# EAGLE design Un_Net_v1.1 (EAGLE 7.3.0)
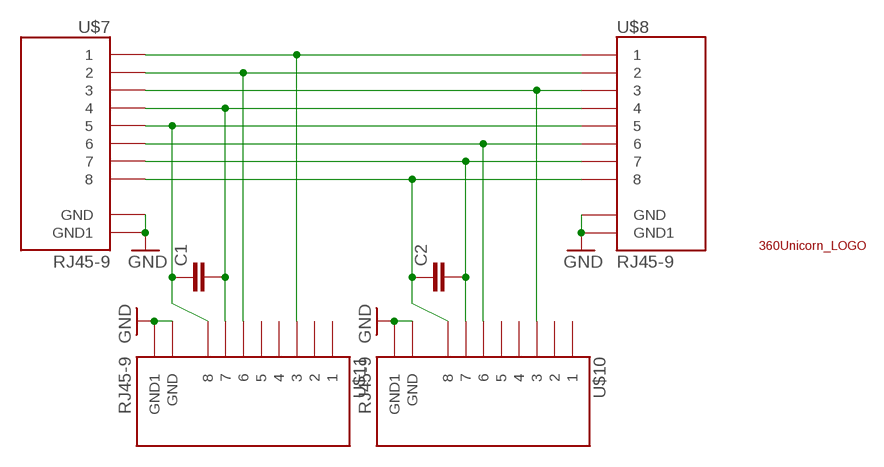
[diagram p0: schematic, sheet 1]

## Parts
C1  CAP1206  [1206]
C2  CAP1206  [1206]
U$1  360UNICORN_LOGO_1Z  [360UNICORN_LOGO_1Z]
U$7  RJ45-9  [RJ45-9]
U$8  RJ45-9  [RJ45-9]
U$10  RJ45-9  [RJ45-9]
U$11  RJ45-9  [RJ45-9]

## Nets
GND: U$7.9(GND) U$7.10(GND1) U$8.9(GND) U$8.10(GND1) U$10.9(GND) U$10.10(GND1) U$11.9(GND) U$11.10(GND1)
N$1: U$7.1 U$8.1 U$11.3
N$2: U$7.2 U$8.2 U$11.6
N$3: U$7.3 U$8.3 U$10.3
N$4: C2.2 U$7.7 U$8.7 U$10.7
N$7: U$7.6 U$8.6 U$10.6
N$8: C1.1 U$7.5 U$8.5 U$11.8
N$9: C1.2 U$7.4 U$8.4 U$11.7
N$10: C2.1 U$7.8 U$8.8 U$10.8
Unconnected: U$10.1 U$10.2 U$10.4 U$10.5 U$11.1 U$11.2 U$11.4 U$11.5

## Library data of the parts
C1 C2 = 2SparkFun:CAP: Capacitor Standard 0603 ceramic capacitor, and 0.1" leaded capacitor.
U$1 = 2SparkFun:360UNICORN_LOGO
U$7 U$8 U$10 U$11 = 2SparkFun:RJ45-9

## Board
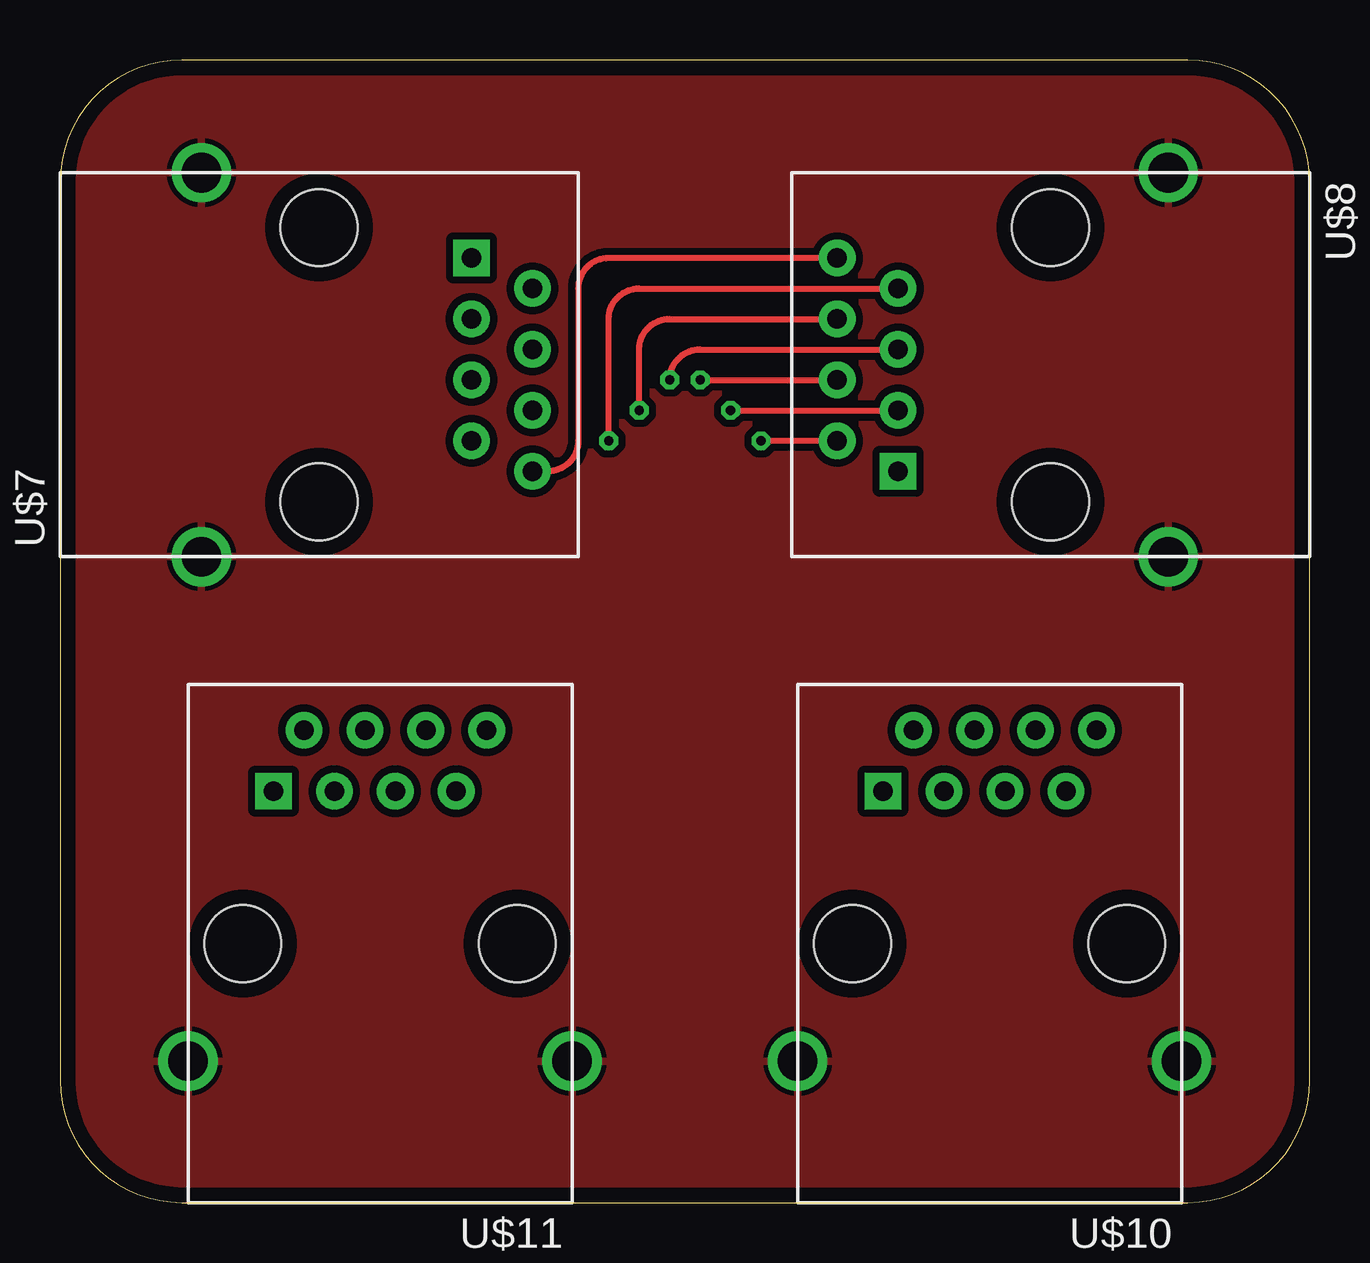
[diagram p1: board, top side]
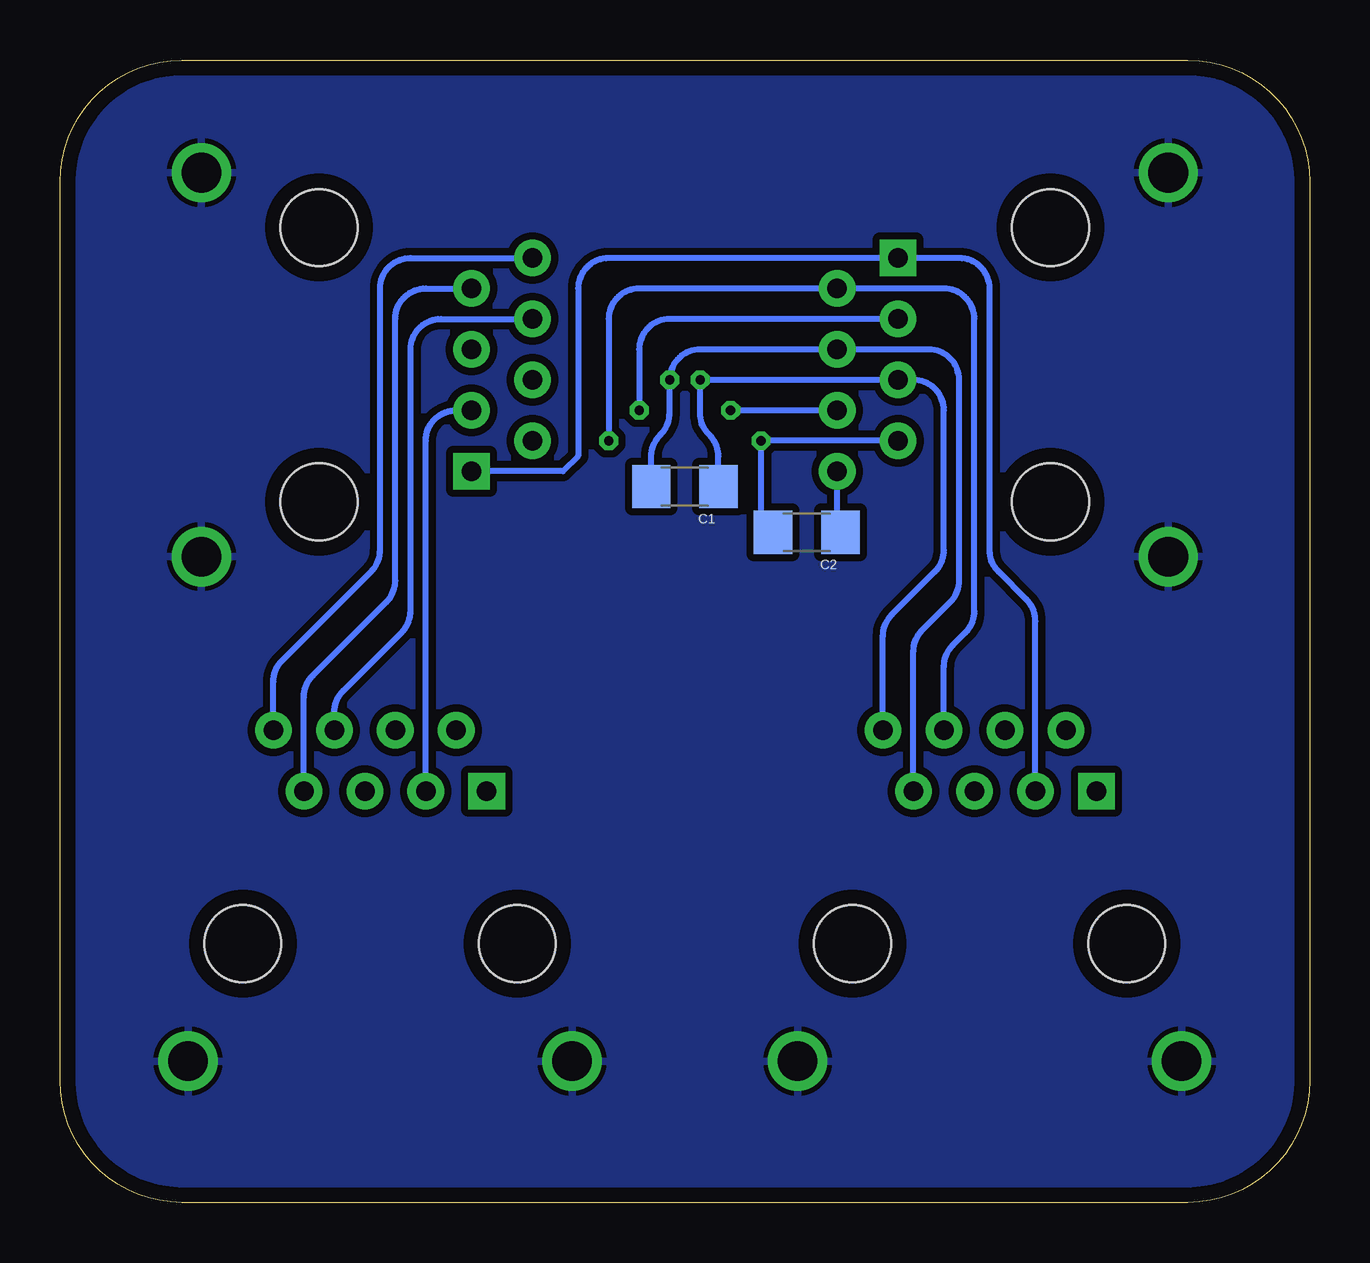
[diagram p2: board, bottom side, seen from below]

Size 52.07 x 47.62 mm. Coordinates in mm from the lower left corner, seen from the top.
Outline: 0,42.55 0,5.08 arc90 5.08,0 46.99,0 arc90 52.07,5.08 52.07,42.55 arc90 46.99,47.62 5.08,47.62 arc90 0,42.55
Copper layers (1*16): Top 0.035mm / dielectric 1.5mm / Bottom 0.035mm
Design rules "yun": minimum track width 8mil, minimum drill 15mil, track to track 8mil, track to pad 8mil, pad to pad 8mil, via to via 8mil, smd to smd 8mil, copper to edge 25mil, drill to drill 8mil, minimum pad ring 10mil, minimum via ring 8mil, stop-mask expansion 4mil, vias tented up to drill 20mil, thermal gap 8mil

### Footprints (pad centres in the part's own frame; a part is rotated, then mirrored left to right if it is on the bottom)
1206 = smd 1.6 x 1.8: 1 -1.4,0; 2 1.4,0
RJ45-9 = drill 0.813 pad 1.524 square: 1 4.445,-7.62 | drill 0.813 pad 1.524: 2 3.175,-10.16; 3 1.905,-7.62; 4 0.635,-10.16; 5 -0.635,-7.62; 6 -1.905,-10.16; 7 -3.175,-7.62; 8 -4.445,-10.16 | drill 1.651 pad 2.159: 9 8.001,3.632; 10 -8.001,3.632 | hole 3.2: 5.715,-1.27; -5.715,-1.27

### Placement (x,y rotation side)
C1  26.04,29.84 180 bottom
C2  20.95,27.94 180 bottom
U$1  30.86,13.33 0 bottom
U$7  9.53,34.93 90 top
U$8  42.55,34.93 270 top
U$10  38.74,9.53 180 top
U$11  13.33,9.53 180 top

### Tracks (layer width: path | path; a pad name or v marks a point on that pad's centre or on a via)
GND
  pour Bottom (isolate 0.305, rank 2): 0,0 52.07,0 52.07,47.62 0,47.62
  pour Top (isolate 0.305, rank 2): 0,0 52.07,0 52.07,47.62 0,47.62
N$1
  Bottom 0.254: U$11.3 11.43,24.24 arc-45 11.8,25.14 12.96,26.3 arc45 13.33,27.2 13.33,38.1 arc-90 14.61,39.37 U$7.1 29.21,39.37 arc-90 30.48,38.1 30.48,31.11 31.11,30.48 U$8.1
N$2  (via drill 0.38)
  Top 0.254: v29.21,31.75 U$8.2
  Bottom 0.254: U$11.6 15.24,22.33 arc45 14.87,23.23 14.34,23.76 arc-45 13.97,24.66 13.97,36.83 arc-90 15.24,38.1 U$7.2 27.94,38.1 arc-90 29.21,36.83 v29.21,31.75
N$3  (via drill 0.38)
  Top 0.254: v27.94,33.02 U$8.3
  Bottom 0.254: U$10.3 36.83,31.75 arc90 35.56,33.02 U$8.3 | U$7.3 26.67,36.83 arc-90 27.94,35.56 v27.94,33.02
N$4  (via drill 0.38)
  Top 0.254: v22.86,31.75 22.86,36.83 arc-90 24.13,38.1 U$8.7
  Bottom 0.254: U$10.7 41.91,21.06 arc45 41.54,21.96 38.47,25.03 arc-45 38.1,25.93 38.1,36.83 arc90 36.83,38.1 U$8.7 | U$7.7 v22.86,31.75 22.86,28.45 C2.2
N$7  (via drill 0.38)
  Top 0.254: v24.13,33.02 24.13,35.56 arc-90 25.4,36.83 U$8.6
  Bottom 0.254: U$10.6 40.64,20.43 arc45 40.27,21.33 37.84,23.76 arc-45 37.47,24.66 37.47,35.56 arc90 36.2,36.83 U$8.6 | U$7.6 v24.13,33.02
N$8  (via drill 0.38)
  Top 0.254: v25.4,34.29 arc-90 26.67,35.56 U$8.5
  Bottom 0.254: U$11.8 17.78,23.6 arc45 17.41,24.5 15.61,26.3 arc-45 15.24,27.2 15.24,33.02 arc-90 16.51,34.29 U$7.5 v25.4,34.29 25.4,32.91 arc-45 25.03,32.01 25.01,31.99 arc45 24.63,31.09 C1.1
N$9  (via drill 0.38)
  Top 0.254: v26.67,34.29 U$8.4
  Bottom 0.254: U$11.7 16.51,22.97 arc45 16.14,23.87 14.98,25.03 arc-45 14.61,25.93 14.61,34.29 arc-90 15.88,35.56 U$7.4 25.4,35.56 arc-90 v26.67,34.29 26.67,32.91 arc45 27.04,32.01 27.06,31.99 arc-45 27.43,31.09 C1.2
N$10
  Top 0.254: U$8.8 22.86,39.37 arc90 21.59,38.1 21.59,31.75 arc-90 20.32,30.48 U$7.8
  Bottom 0.254: U$10.8 43.18,21.7 arc45 42.81,22.6 39.11,26.3 arc-45 38.74,27.2 38.74,38.1 arc90 37.47,39.37 U$8.8 | C2.1 19.68,28.07 U$7.8

### Text on the board
tStop: HackNET V1.1
bStop: HackNET V1.1